# EAGLE schematic 433schematic (EAGLE 9.2.2)
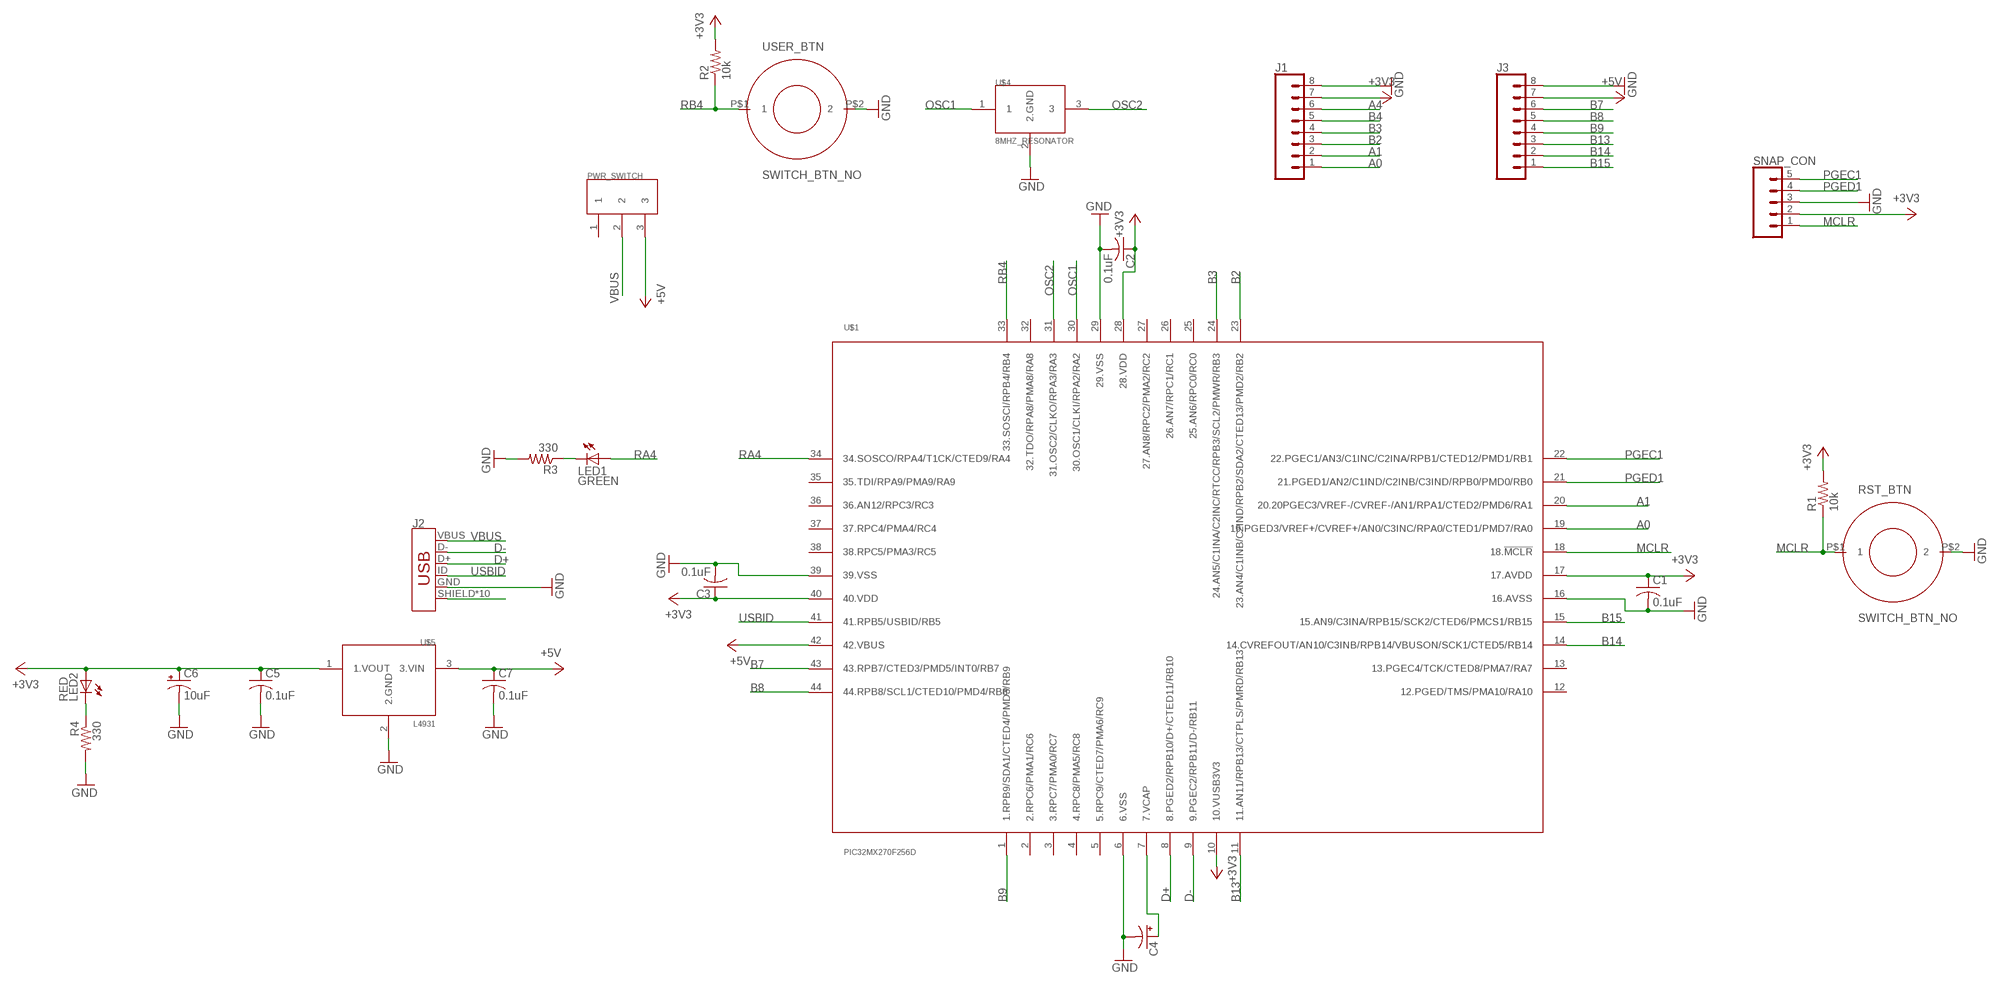
[diagram p0: schematic, sheet 1]

## Parts
C1  0.1uF  C-US025-024X044  [C025-024X044]
C2  0.1uF  C-US025-024X044  [C025-024X044]
C3  0.1uF  C-US025-024X044  [C025-024X044]
C4  CPOL-USB45181A  [B45181A]
C5  0.1uF  C-US025-024X044  [C025-024X044]
C6  10uF  CPOL-USB45181A  [B45181A]
C7  0.1uF  C-US025-024X044  [C025-024X044]
J1  CONN_08"  [1X08]
J2  USB_MICRO-B_HALF_PTH_MILL  [USB-MICROB-PTH-MILL]
J3  CONN_08"  [1X08]
LED1  GREEN  LED3MM  [LED3MM]
LED2  RED  LED3MM  [LED3MM]
PWR_SWITCH  SLIDE_SWITCH  [SLIDE_SWITCH]
R1  10k  R-US_0204/5  [0204/5]
R2  10k  R-US_0204/5  [0204/5]
R3  330  R-US_0204/5  [0204/5]
R4  330  R-US_0204/5  [0204/5]
RST_BTN  SWITCH_BTN_NO  [BTN_2]
SNAP_CON  CONN_05  [1X05]
U$1  PIC32MX270F256D  [TQFP44]
U$4  8MHZ_RESONATOR  [8MHZ_RESONATOR]
U$5  L4931  [TO92]
USER_BTN  SWITCH_BTN_NO  [BTN_2]

## Nets
+3V3: C1.1 C2.1 C3.1 C5.1 C6.+ J1.7 LED2.A R1.2 R2.2 SNAP_CON.2 U$1.10(10.VUSB3V3) U$1.17(17.AVDD) U$1.28(28.VDD) U$1.40(40.VDD) U$5.1(1.VOUT)
+5V: C7.1 J3.7 PWR_SWITCH.3 U$1.42(42.VBUS) U$5.3(3.VIN)
A0: J1.1 U$1.19(19.PGED3/VREF+/CVREF+/AN0/C3INC/RPA0/CTED1/PMD7/RA0)
A1: J1.2 U$1.20(20.20PGEC3/VREF-/CVREF-/AN1/RPA1/CTED2/PMD6/RA1)
A4: J1.6
B2: J1.3 U$1.23(23.AN4/C1INB/C2IND/RPB2/SDA2/CTED13/PMD2/RB2)
B3: J1.4 U$1.24(24.AN5/C1INA/C2INC/RTCC/RPB3/SCL2/PMWR/RB3)
B4: J1.5
B7: J3.6 U$1.43(43.RPB7/CTED3/PMD5/INT0/RB7)
B8: J3.5 U$1.44(44.RPB8/SCL1/CTED10/PMD4/RB8)
B9: J3.4 U$1.1(1.RPB9/SDA1/CTED4/PMD3/RB9)
B13: J3.3 U$1.11(11.AN11/RPB13/CTPLS/PMRD/RB13)
B14: J3.2 U$1.14(14.CVREFOUT/AN10/C3INB/RPB14/VBUSON/SCK1/CTED5/RB14)
B15: J3.1 U$1.15(15.AN9/C3INA/RPB15/SCK2/CTED6/PMCS1/RB15)
D+: J2.D+ U$1.8(8.PGED2/RPB10/D+/CTED11/RB10)
D-: J2.D- U$1.9(9.PGEC2/RPB11/D-/RB11)
GND: C1.2 C2.2 C3.2 C4.- C5.2 C6.- C7.2 J1.8 J2.GND J3.8 R3.2 R4.2 RST_BTN.P$2 SNAP_CON.3 U$1.6(6.VSS) U$1.16(16.AVSS) U$1.29(29.VSS) U$1.39(39.VSS) U$4.2(2.GND) U$5.2(2.GND) USER_BTN.P$2
MCLR: R1.1 RST_BTN.P$1 SNAP_CON.1 U$1.18(18.!MCLR!)
N$1: LED1.K(C) R3.1
N$2: LED2.K(C) R4.1
N$4: C4.+ U$1.7(7.VCAP)
N$9: J2.SHIELD J2.SHIELD2(SHIELD) J2.SHIELD3(SHIELD) J2.SHIELD4(SHIELD) J2.SHIELD5(SHIELD) J2.SHIELD6(SHIELD) J2.SHIELD7(SHIELD) J2.SHIELD8(SHIELD) J2.SHIELD9(SHIELD) J2.SHIELD10(SHIELD)
OSC1: U$1.30(30.OSC1/CLKI/RPA2/RA2) U$4.1
OSC2: U$1.31(31.OSC2/CLKO/RPA3/RA3) U$4.3
PGEC1: SNAP_CON.5 U$1.22(22.PGEC1/AN3/C1INC/C2INA/RPB1/CTED12/PMD1/RB1)
PGED1: SNAP_CON.4 U$1.21(21.PGED1/AN2/C1IND/C2INB/C3IND/RPB0/PMD0/RB0)
RA4: LED1.A U$1.34(34.SOSCO/RPA4/T1CK/CTED9/RA4)
RB4: R2.1 U$1.33(33.SOSCI/RPB4/RB4) USER_BTN.P$1
USBID: J2.ID U$1.41(41.RPB5/USBID/RB5)
VBUS: J2.VBUS PWR_SWITCH.2
Unconnected: PWR_SWITCH.1 U$1.2(2.RPC6/PMA1/RC6) U$1.3(3.RPC7/PMA0/RC7) U$1.4(4.RPC8/PMA5/RC8) U$1.5(5.RPC9/CTED7/PMA6/RC9) U$1.12(12.PGED/TMS/PMA10/RA10) U$1.13(13.PGEC4/TCK/CTED8/PMA7/RA7) U$1.25(25.AN6/RPC0/RC0) U$1.26(26.AN7/RPC1/RC1) U$1.27(27.AN8/RPC2/PMA2/RC2) U$1.32(32.TDO/RPA8/PMA8/RA8) U$1.35(35.TDI/RPA9/PMA9/RA9) U$1.36(36.AN12/RPC3/RC3) U$1.37(37.RPC4/PMA4/RC4) U$1.38(38.RPC5/PMA3/RC5)

## Library data of the parts
C1-C3 C5 C7 = 433lib:C-US: CAPACITOR, American symbol; SPICEPREFIX: C
C4 C6 = 433lib:CPOL-US: POLARIZED CAPACITOR, American symbol; SPICEPREFIX: C
J1 J3 = SparkFun-Connectors:CONN_08: Multi connection point. Often used as Generic Header-pin footprint for 0.1 inch spaced/style header connections On any of the 0.1 inch spaced packages, you can populate with these: Break Away Headers - Straight <https://www.sparkfun.com/products/116> (PRT-00116) Break Away Male Headers - Right Angle <https://www.sparkfun.com/products/553> (PRT-00553) Female Headers <https://www.sparkfun.com/products/115> (PRT-00115) Break Away Headers - Machine Pin <https://www.sparkfun.com/products/117> (PRT-00117) Break Away Female Headers - Swiss Machine Pin <https://www.sparkfun.com/products/743> (PRT-00743) Arduino Stackable Header - 8 Pin <https://www.sparkfun.com/products/9279> (PRT-09279) For SCREWTERMINALS and SPRING TERMINALS visit here: Screw Terimnals on SparkFun.com <https://www.sparkfun.com/search/results?term=Screw+Terminals> (5mm/3.5mm/2.54mm spacing) This device is also useful as a general connection point to wire up your design to another part of your project. Our various solder wires solder well into these plated through hole pads. Hook-Up Wire - Assortment (Stranded, 22 AWG) <https://www.sparkfun.com/products/11375> (PRT-11375) Hook-Up Wire - Assortment (Solid Core, 22 AWG) <https://www.sparkfun.com/products/11367> (PRT-11367) View the entire wire category on our website here <https://www.sparkfun.com/categories/141> Special notes: Molex polarized connector foot print use with SKU : PRT-08231 with associated crimp pins and housings. 1MM SMD Version SKU: PRT-10208 NOTES ON THE VARIANTS LOCK and LOCK_LONGPADS... This footprint was designed to help hold the alignment of a through-hole component (i.e. 6-pin header) while soldering it into place. You may notice that each hole has been shifted either up or down by 0.005 of an inch from it's more standard position (which is a perfectly straight line). This slight alteration caused the pins (the squares in the middle) to touch the edges of the holes. Because they are alternating, it causes a "brace" to hold the component in place. 0.005 has proven to be the perfect amount of "off-center" position when using our standard breakaway headers. Although looks a little odd when you look at the bare footprint, once you have a header in there, the alteration is very hard to notice. Also,if you push a header all the way into place, it is covered up entirely on the bottom side.; PROD_ID: CONN-08438
J2 = 433lib:USB_MICRO-B: USB Type Micro-B Connector Male/female and PTH/SMT variants SparkFun Products: SparkFun microB USB Breakout <https://www.sparkfun.com/products/12035> SparkFun USB microB Plug Breakout <https://www.sparkfun.com/products/10031> SparkFun ESP8266 Thing <https://www.sparkfun.com/products/13231>; PROD_ID: CONN-13711
LED1 LED2 = 433lib:LED: LED OSRAM: - CHIPLED LG R971, LG N971, LY N971, LG Q971, LY Q971, LO R971, LY R971 LH N974, LH R974 LS Q976, LO Q976, LY Q976 LO Q996 - Hyper CHIPLED LW Q18S LB Q993, LB Q99A, LB R99A - SideLED LS A670, LO A670, LY A670, LG A670, LP A670 LB A673, LV A673, LT A673, LW A673 LH A674 LY A675 LS A676, LA A676, LO A676, LY A676, LW A676 LS A679, LY A679, LG A679 - Hyper Micro SIDELED® LS Y876, LA Y876, LO Y876, LY Y876 LT Y87S - SmartLED LW L88C, LW L88S LB L89C, LB L89S, LG L890 LS L89K, LO L89K, LY L89K LS L896, LA L896, LO L896, LY L896 - TOPLED LS T670, LO T670, LY T670, LG T670, LP T670 LSG T670, LSP T670, LSY T670, LOP T670, LYG T670 LG T671, LOG T671, LSG T671 LB T673, LV T673, LT T673, LW T673 LH T674 LS T676, LA T676, LO T676, LY T676, LB T676, LH T676, LSB T676, LW T676 LB T67C, LV T67C, LT T67C, LS T67K, LO T67K, LY T67K, LW E67C LS E67B, LA E67B, LO E67B, LY E67B, LB E67C, LV E67C, LT E67C LW T67C LS T679, LY T679, LG T679 LS T770, LO T770, LY T770, LG T770, LP T770 LB T773, LV T773, LT T773, LW T773 LH T774 LS E675, LA E675, LY E675, LS T675 LS T776, LA T776, LO T776, LY T776, LB T776 LHGB T686 LT T68C, LB T68C - Hyper Mini TOPLED® LB M676 - Mini TOPLED Santana® LG M470 LS M47K, LO M47K, LY M47K Source: http://www.osram.convergy.de LUXEON: - LUMILED® LXK2-PW12-R00, LXK2-PW12-S00, LXK2-PW14-U00, LXK2-PW14-V00 LXK2-PM12-R00, LXK2-PM12-S00, LXK2-PM14-U00 LXK2-PE12-Q00, LXK2-PE12-R00, LXK2-PE12-S00, LXK2-PE14-T00, LXK2-PE14-U00 LXK2-PB12-K00, LXK2-PB12-L00, LXK2-PB12-M00, LXK2-PB14-N00, LXK2-PB14-P00, LXK2-PB14-Q00 LXK2-PR12-L00, LXK2-PR12-M00, LXK2-PR14-Q00, LXK2-PR14-R00 LXK2-PD12-Q00, LXK2-PD12-R00, LXK2-PD12-S00 LXK2-PH12-R00, LXK2-PH12-S00 LXK2-PL12-P00, LXK2-PL12-Q00, LXK2-PL12-R00 Source: www.luxeon.com KINGBRIGHT: KA-3528ASYC Source: www.kingbright.com
PWR_SWITCH = 433lib:SLIDE_SWITCH
R1-R4 = 433lib:R-US_: RESISTOR, American symbol; SPICEPREFIX: R
RST_BTN USER_BTN = 433lib:SWITCH_BTN_NO: Standard through-hole button
SNAP_CON = SparkFun-Connectors:CONN_05: Multi connection point. Often used as Generic Header-pin footprint for 0.1 inch spaced/style header connections On any of the 0.1 inch spaced packages, you can populate with these: Break Away Headers - Straight <https://www.sparkfun.com/products/116> (PRT-00116) Break Away Male Headers - Right Angle <https://www.sparkfun.com/products/553> (PRT-00553) Female Headers <https://www.sparkfun.com/products/115> (PRT-00115) Break Away Headers - Machine Pin <https://www.sparkfun.com/products/117> (PRT-00117) Break Away Female Headers - Swiss Machine Pin <https://www.sparkfun.com/products/743> (PRT-00743) For SCREWTERMINALS and SPRING TERMINALS visit here: Screw Terimnals on SparkFun.com <https://www.sparkfun.com/search/results?term=Screw+Terminals> (5mm/3.5mm/2.54mm spacing) This device is also useful as a general connection point to wire up your design to another part of your project. Our various solder wires solder well into these plated through hole pads. Hook-Up Wire - Assortment (Stranded, 22 AWG) <https://www.sparkfun.com/products/11375> (PRT-11375) Hook-Up Wire - Assortment (Solid Core, 22 AWG) <https://www.sparkfun.com/products/11367> (PRT-11367) View the entire wire category on our website here <https://www.sparkfun.com/categories/141> Special notes: Molex polarized connector foot print use with SKU : PRT-08231 with associated crimp pins and housings. 1MM SMD Version SKU: PRT-10208
U$1 = 433lib:PIC32MX270F256D: 44-pin TQFP PIC32MX270F256D used in ME433
U$4 = 433lib:8MHZ_RESONATOR: Through-hole 3 pin resonator
U$5 = 433lib:L4931: Through-hole 5V to 3V3 Voltage regulator for ME433 Class